# EAGLE design 1 (EAGLE 6.1)
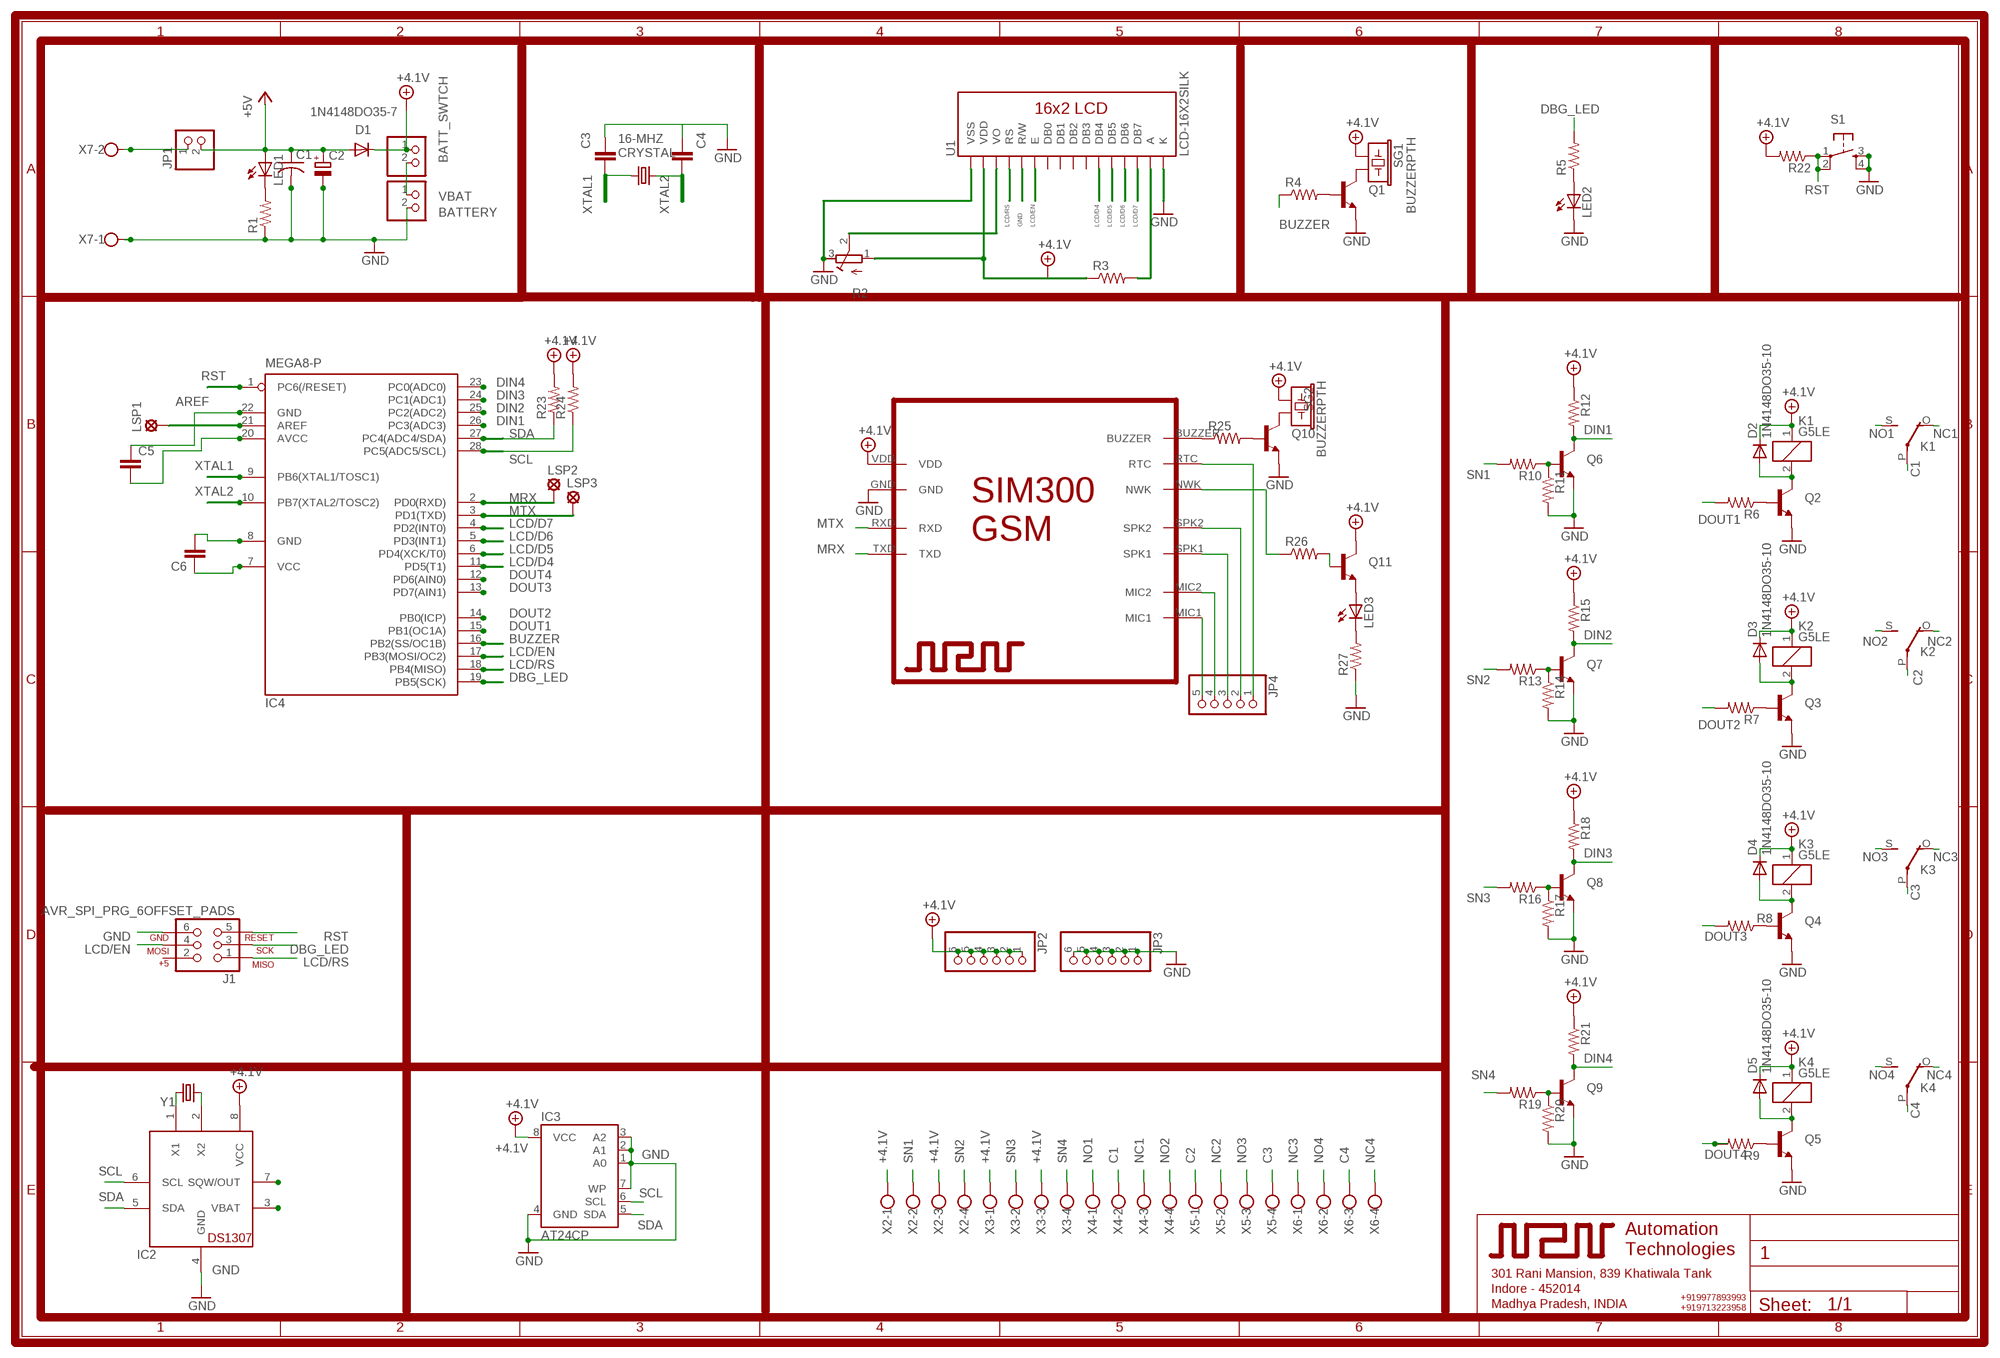
[diagram p0: schematic, sheet 1]

## Parts
BATT_SWTCH  PINHD-1X2  [1X02]
BATTERY  PINHD-1X2  [1X02]
C1  C-US050-035X075  [C050-035X075]
C2  CPOL-EUE3.5-8  [E3,5-8]
C3  CAPPTH1  [CAP-PTH-5MM]
C4  CAPPTH1  [CAP-PTH-5MM]
C5  CAPPTH1  [CAP-PTH-5MM]
C6  CAPPTH1  [CAP-PTH-5MM]
CRYSTAL  16-MHZ  CRYSTALHC49UV  [HC49U-V]
D1  1N4148DO35-7  [DO35-7]
D2  1N4148DO35-10  [DO35-10]
D3  1N4148DO35-10  [DO35-10]
D4  1N4148DO35-10  [DO35-10]
D5  1N4148DO35-10  [DO35-10]
IC2  DS1307  [DIL08]
IC3  AT24CP  [DIL08]
IC4  MEGA8-P  [DIL28-3]
J1  AVR_SPI_PRG_6OFFSET_PADS  [2X3_OFFSET]
JP1  PINHD-1X2  [1X02]
JP2  PINHD-1X6  [1X06]
JP3  PINHD-1X6  [1X06]
JP4  PINHD-1X5  [1X05]
K1  G5LE  [G5LE]
K2  G5LE  [G5LE]
K3  G5LE  [G5LE]
K4  G5LE  [G5LE]
LED1  LED5MM  [LED5MM]
LED2  LED5MM  [LED5MM]
LED3  LED5MM  [LED5MM]
LSP1  LSP11  [LSP11]
LSP2  MCS10B  [MCS10B]
LSP3  MCS10B  [MCS10B]
Q1  TRANSISTOR_NPNTO-92-AMMO  [TO-92-AMMO]
Q2  TRANSISTOR_NPNTO-92-AMMO  [TO-92-AMMO]
Q3  TRANSISTOR_NPNTO-92-AMMO  [TO-92-AMMO]
Q4  TRANSISTOR_NPNTO-92-AMMO  [TO-92-AMMO]
Q5  TRANSISTOR_NPNTO-92-AMMO  [TO-92-AMMO]
Q6  TRANSISTOR_NPNTO-92-AMMO  [TO-92-AMMO]
Q7  TRANSISTOR_NPNTO-92-AMMO  [TO-92-AMMO]
Q8  TRANSISTOR_NPNTO-92-AMMO  [TO-92-AMMO]
Q9  TRANSISTOR_NPNTO-92-AMMO  [TO-92-AMMO]
Q10  TRANSISTOR_NPNTO-92-AMMO  [TO-92-AMMO]
Q11  TRANSISTOR_NPNTO-92-AMMO  [TO-92-AMMO]
R1  RESISTORPTH-1/2W  [AXIAL-0.5]
R2  R-TRIMM3339P  [RTRIM3339P]
R3  RESISTORPTH-1/2W  [AXIAL-0.5]
R4  RESISTORPTH-1/2W  [AXIAL-0.5]
R5  RESISTORPTH-1/2W  [AXIAL-0.5]
R6  RESISTORPTH-1/2W  [AXIAL-0.5]
R7  RESISTORPTH-1/2W  [AXIAL-0.5]
R8  RESISTORPTH-1/2W  [AXIAL-0.5]
R9  RESISTORPTH-1/2W  [AXIAL-0.5]
R10  RESISTORPTH-1/2W  [AXIAL-0.5]
R11  RESISTORPTH-1/2W  [AXIAL-0.5]
R12  RESISTORPTH-1/2W  [AXIAL-0.5]
R13  RESISTORPTH-1/2W  [AXIAL-0.5]
R14  RESISTORPTH-1/2W  [AXIAL-0.5]
R15  RESISTORPTH-1/2W  [AXIAL-0.5]
R16  RESISTORPTH-1/2W  [AXIAL-0.5]
R17  RESISTORPTH-1/2W  [AXIAL-0.5]
R18  RESISTORPTH-1/2W  [AXIAL-0.5]
R19  RESISTORPTH-1/2W  [AXIAL-0.5]
R20  RESISTORPTH-1/2W  [AXIAL-0.5]
R21  RESISTORPTH-1/2W  [AXIAL-0.5]
R22  RESISTORPTH-1/2W  [AXIAL-0.5]
R23  RESISTORPTH-1/2W  [AXIAL-0.5]
R24  RESISTORPTH-1/2W  [AXIAL-0.5]
R25  RESISTORPTH-1/2W  [AXIAL-0.5]
R26  RESISTORPTH-1/2W  [AXIAL-0.5]
R27  RESISTORPTH-1/2W  [AXIAL-0.5]
S1  TAC_SWITCHPTH  [TACTILE-PTH]
SG1  BUZZERPTH  [BUZZER-12MM]
SG2  BUZZERPTH  [BUZZER-12MM]
U1  LCD-16X2SILK  [LCD-16X2]
U$1  SIM300  [1X10]
X2  W237-4  [W237-4]
X3  W237-4  [W237-4]
X4  W237-4  [W237-4]
X5  W237-4  [W237-4]
X6  W237-4  [W237-4]
X7  W237-102  [W237-102]
Y1  CRYSTALTC38H  [TC38H]

## Nets
+4.1V: BATT_SWTCH.1 C5.2 C6.1 D1.C D2.C D3.C D4.C D5.C IC2.8(VCC) IC3.8(VCC) IC4.7(VCC) IC4.20(AVCC) JP2.1 JP2.2 JP2.3 JP2.4 JP2.5 JP2.6 K1.1 K2.1 K3.1 K4.1 Q11.3(C) R2.1(A) R3.P$1 R12.P$1 R15.P$1 R18.P$1 R21.P$1 R22.P$2 R23.P$2 R24.P$2 SG1.+ SG2.+ U1.2(VDD) U$1.VDD X2.1 X2.3 X3.1 X3.3
+5V: C1.1 C2.+ D1.A JP1.2 LED1.A
AREF: IC4.21(AREF) LSP1.MP
BUZZER: IC4.16(PB2(SS/OC1B)) R4.P$1
C1: K1.P(2:P) X4.2
C2: K2.P(2:P) X5.1
C3: K3.P(2:P) X5.4
C4: K4.P(2:P) X6.3
DBG_LED: IC4.19(PB5(SCK)) J1.3 R5.P$2
DIN1: IC4.26(PC3(ADC3)) Q6.3(C) R12.P$2
DIN2: IC4.25(PC2(ADC2)) Q7.3(C) R15.P$2
DIN3: IC4.24(PC1(ADC1)) Q8.3(C) R18.P$2
DIN4: IC4.23(PC0(ADC0)) Q9.3(C) R21.P$2
DOUT1: IC4.15(PB1(OC1A)) R6.P$2
DOUT2: IC4.14(PB0(ICP)) R7.P$2
DOUT3: IC4.13(PD7(AIN1)) R8.P$2
DOUT4: IC4.12(PD6(AIN0)) R9.P$2
GND: BATTERY.2 C1.2 C2.- C3.1 C4.1 C5.1 C6.2 IC2.4(GND) IC3.1(A0) IC3.2(A1) IC3.3(A2) IC3.4(GND) IC3.7(WP) IC4.8(GND) IC4.22(GND) J1.6 JP3.1 JP3.2 JP3.3 JP3.4 JP3.5 JP3.6 LED2.K(C) Q1.1(E) Q2.1(E) Q3.1(E) Q4.1(E) Q5.1(E) Q6.1(E) Q7.1(E) Q8.1(E) Q9.1(E) Q10.1(E) R1.P$1 R2.3(E) R11.P$2 R14.P$2 R17.P$2 R20.P$2 R27.P$1 S1.3 S1.4 U1.1(VSS) U1.5(R/W) U1.16(K) U$1.GND X7.1
LCD/D4: IC4.11(PD5(T1)) U1.11(DB4)
LCD/D5: IC4.6(PD4(XCK/T0)) U1.12(DB5)
LCD/D6: IC4.5(PD3(INT1)) U1.13(DB6)
LCD/D7: IC4.4(PD2(INT0)) U1.14(DB7)
LCD/EN: IC4.17(PB3(MOSI/OC2)) J1.4 U1.6(E)
LCD/RS: IC4.18(PB4(MISO)) J1.1 U1.4(RS)
MRX: IC4.2(PD0(RXD)) LSP2.MP U$1.TXD
MTX: IC4.3(PD1(TXD)) LSP3.MP U$1.RXD
N$1: JP1.1 X7.2
N$2: LED1.K(C) R1.P$2
N$3: LED3.A Q11.1(E)
N$6: R2.2(S) U1.3(VO)
N$7: Q1.3(C) SG1.-
N$8: Q1.2(B) R4.P$2
N$9: LED2.A R5.P$1
N$10: D2.A K1.2 Q2.3(C)
N$11: Q2.2(B) R6.P$1
N$12: D3.A K2.2 Q3.3(C)
N$13: Q3.2(B) R7.P$1
N$14: R3.P$2 U1.15(A)
N$17: D4.A K3.2 Q4.3(C)
N$18: Q4.2(B) R8.P$1
N$19: D5.A K4.2 Q5.3(C)
N$20: Q5.2(B) R9.P$1
N$21: Q6.2(B) R10.P$1 R11.P$1
N$22: JP4.5 U$1.MIC1
N$23: JP4.4 U$1.MIC2
N$24: JP4.3 U$1.SPK1
N$25: Q7.2(B) R13.P$1 R14.P$1
N$26: JP4.2 U$1.SPK2
N$27: JP4.1 U$1.RTC
N$28: Q8.2(B) R16.P$1 R17.P$1
N$29: IC2.1(X1) Y1.2
N$30: R25.P$1 U$1.BUZZER
N$31: Q9.2(B) R19.P$1 R20.P$1
N$32: IC2.2(X2) Y1.1
N$33: Q10.2(B) R25.P$2
N$34: Q10.3(C) SG2.-
N$35: Q11.2(B) R26.P$2
N$36: LED3.K(C) R27.P$2
N$37: R26.P$1 U$1.NWK
N$40: IC2.7(SQW/OUT)
NC1: K1.O(2:O) X4.3
NC2: K2.O(2:O) X5.2
NC3: K3.O(2:O) X6.1
NC4: K4.O(2:O) X6.4
NO1: K1.S(2:S) X4.1
NO2: K2.S(2:S) X4.4
NO3: K3.S(2:S) X5.3
NO4: K4.S(2:S) X6.2
RST: IC4.1(PC6(/RESET)) J1.5 R22.P$1 S1.1 S1.2
SCL: IC2.6(SCL) IC3.6(SCL) IC4.28(PC5(ADC5/SCL)) R24.P$1
SDA: IC2.5(SDA) IC3.5(SDA) IC4.27(PC4(ADC4/SDA)) R23.P$1
SN1: R10.P$2 X2.2
SN2: R13.P$2 X2.4
SN3: R16.P$2 X3.2
SN4: R19.P$2 X3.4
VBAT: BATT_SWTCH.2 BATTERY.1 IC2.3(VBAT)
XTAL1: C3.2 CRYSTAL.1 IC4.9(PB6(XTAL1/TOSC1))
XTAL2: C4.2 CRYSTAL.2 IC4.10(PB7(XTAL2/TOSC2))
Unconnected: J1.2 U1.7(DB0) U1.8(DB1) U1.9(DB2) U1.10(DB3)

## Library data of the parts
BATT_SWTCH BATTERY JP1 = pinhead:PINHD-1X2: PIN HEADER
C1 = rcl:C-US: CAPACITOR, American symbol
C2 = rcl:CPOL-EU: POLARIZED CAPACITOR, European symbol
C3-C6 = SparkFun_NPN:CAP: Capacitor Standard 0603 ceramic capacitor, and 0.1" leaded capacitor.
CRYSTAL Y1 = SparkFun_NPN:CRYSTAL: Crystals Various standard crystals. Proven footprints. Spark Fun Electronics SKU : COM-00534
D1-D5 = diode:1N4148: DIODE high speed (Philips)
IC2 = adafruit:DS1307: DS1307 Real time clock (RTC) with battery backup ability. Talk to it via i2c
IC3 = atmel:AT24C*: 2-wire serial EEPROM; MPN: AT24C1024BW-SH-B; OC_FARNELL: 1362646; OC_NEWARK: 03P2044
IC4 = atmel:MEGA8-P: MICROCONTROLLER 8 Kbytes FLASH, 1 kbytes SRAM, 512 bytes EEPROM, USART, 4-channel 10 bit ADC, 2-channel 8 bit ADC Pin compatible with Atmega48, ATMega88, ATMega168 Source: avr.lbr; OC_FARNELL: unknown; OC_NEWARK: unknown
J1 = SparkFun:AVR_SPI_PRG_6: AVR ISP 6 Pin This is the reduced ISP connector for AVR programming. Common on Arduino. This footprint will take up less PCB space and can be used with a 10-pin to 6-pin adapter such as SKU: BOB-08508
JP2 JP3 = pinhead:PINHD-1X6: PIN HEADER
JP4 = pinhead:PINHD-1X5: PIN HEADER
K1-K4 = relay:G5LE: RELAY 1 x switch, 10 A/120 V AC, 8 A/30 V DC, Omron; OC_FARNELL: unknown; OC_NEWARK: unknown
LED1-LED3 = led:LED: LED OSRAM: - CHIPLED LG R971, LG N971, LY N971, LG Q971, LY Q971, LO R971, LY R971 LH N974, LH R974 LS Q976, LO Q976, LY Q976 LO Q996 - Hyper CHIPLED LW Q18S LB Q993, LB Q99A, LB R99A - SideLED LS A670, LO A670, LY A670, LG A670, LP A670 LB A673, LV A673, LT A673, LW A673 LH A674 LY A675 LS A676, LA A676, LO A676, LY A676, LW A676 LS A679, LY A679, LG A679 - Hyper Micro SIDELED® LS Y876, LA Y876, LO Y876, LY Y876 LT Y87S - SmartLED LW L88C, LW L88S LB L89C, LB L89S, LG L890 LS L89K, LO L89K, LY L89K LS L896, LA L896, LO L896, LY L896 - TOPLED LS T670, LO T670, LY T670, LG T670, LP T670 LSG T670, LSP T670, LSY T670, LOP T670, LYG T670 LG T671, LOG T671, LSG T671 LB T673, LV T673, LT T673, LW T673 LH T674 LS T676, LA T676, LO T676, LY T676, LB T676, LH T676, LSB T676, LW T676 LB T67C, LV T67C, LT T67C, LS T67K, LO T67K, LY T67K, LW E67C LS E67B, LA E67B, LO E67B, LY E67B, LB E67C, LV E67C, LT E67C LW T67C LS T679, LY T679, LG T679 LS T770, LO T770, LY T770, LG T770, LP T770 LB T773, LV T773, LT T773, LW T773 LH T774 LS E675, LA E675, LY E675, LS T675 LS T776, LA T776, LO T776, LY T776, LB T776 LHGB T686 LT T68C, LB T68C - Hyper Mini TOPLED® LB M676 - Mini TOPLED Santana® LG M470 LS M47K, LO M47K, LY M47K Source: http://www.osram.convergy.de LUXEON: - LUMILED® LXK2-PW12-R00, LXK2-PW12-S00, LXK2-PW14-U00, LXK2-PW14-V00 LXK2-PM12-R00, LXK2-PM12-S00, LXK2-PM14-U00 LXK2-PE12-Q00, LXK2-PE12-R00, LXK2-PE12-S00, LXK2-PE14-T00, LXK2-PE14-U00 LXK2-PB12-K00, LXK2-PB12-L00, LXK2-PB12-M00, LXK2-PB14-N00, LXK2-PB14-P00, LXK2-PB14-Q00 LXK2-PR12-L00, LXK2-PR12-M00, LXK2-PR14-Q00, LXK2-PR14-R00 LXK2-PD12-Q00, LXK2-PD12-R00, LXK2-PD12-S00 LXK2-PH12-R00, LXK2-PH12-S00 LXK2-PL12-P00, LXK2-PL12-Q00, LXK2-PL12-R00 Source: www.luxeon.com KINGBRIGHT: KA-3528ASYC Source: www.kingbright.com
LSP1 = solpad:LSP11: SOLDER PAD drill 1.1 mm
LSP2 LSP3 = solpad:MCS10B: SOLDER PAD MC S1, distributor Buerklin, 15F505
Q1-Q11 = SparkFun_NPN:TRANSISTOR_NPN: Transistor NPN BJT configuration in SOT23 package. MMBT2222 is the common NPN we use. Double check BCE configuration again layout.
R1 R3-R27 = SparkFun_NPN:RESISTOR: Resistor Basic schematic elements and footprints for 0603, 1206, and PTH resistors.
R2 = rcl:R-TRIMM: Trimm resistor
S1 = SparkFun_NPN:TAC_SWITCH: Momentary Switch Button commonly used for reset or general input. Spark Fun Electronics SKU : COM-00097
SG1 SG2 = SparkFun_NPN:BUZZER: Buzzer 12mm Spark Fun Electronics SKU : Comp-Buzzer
U1 = SparkFun_NPN:LCD-16X2
U$1 = NPN:SIM300
X2-X6 = con-wago-500:W237-4: WAGO SCREW CLAMP; OC_FARNELL: unknown; OC_NEWARK: unknown
X7 = con-wago-500:W237-102: WAGO SCREW CLAMP; MPN: 237-102; OC_FARNELL: unknown; OC_NEWARK: 70K9898

## Board
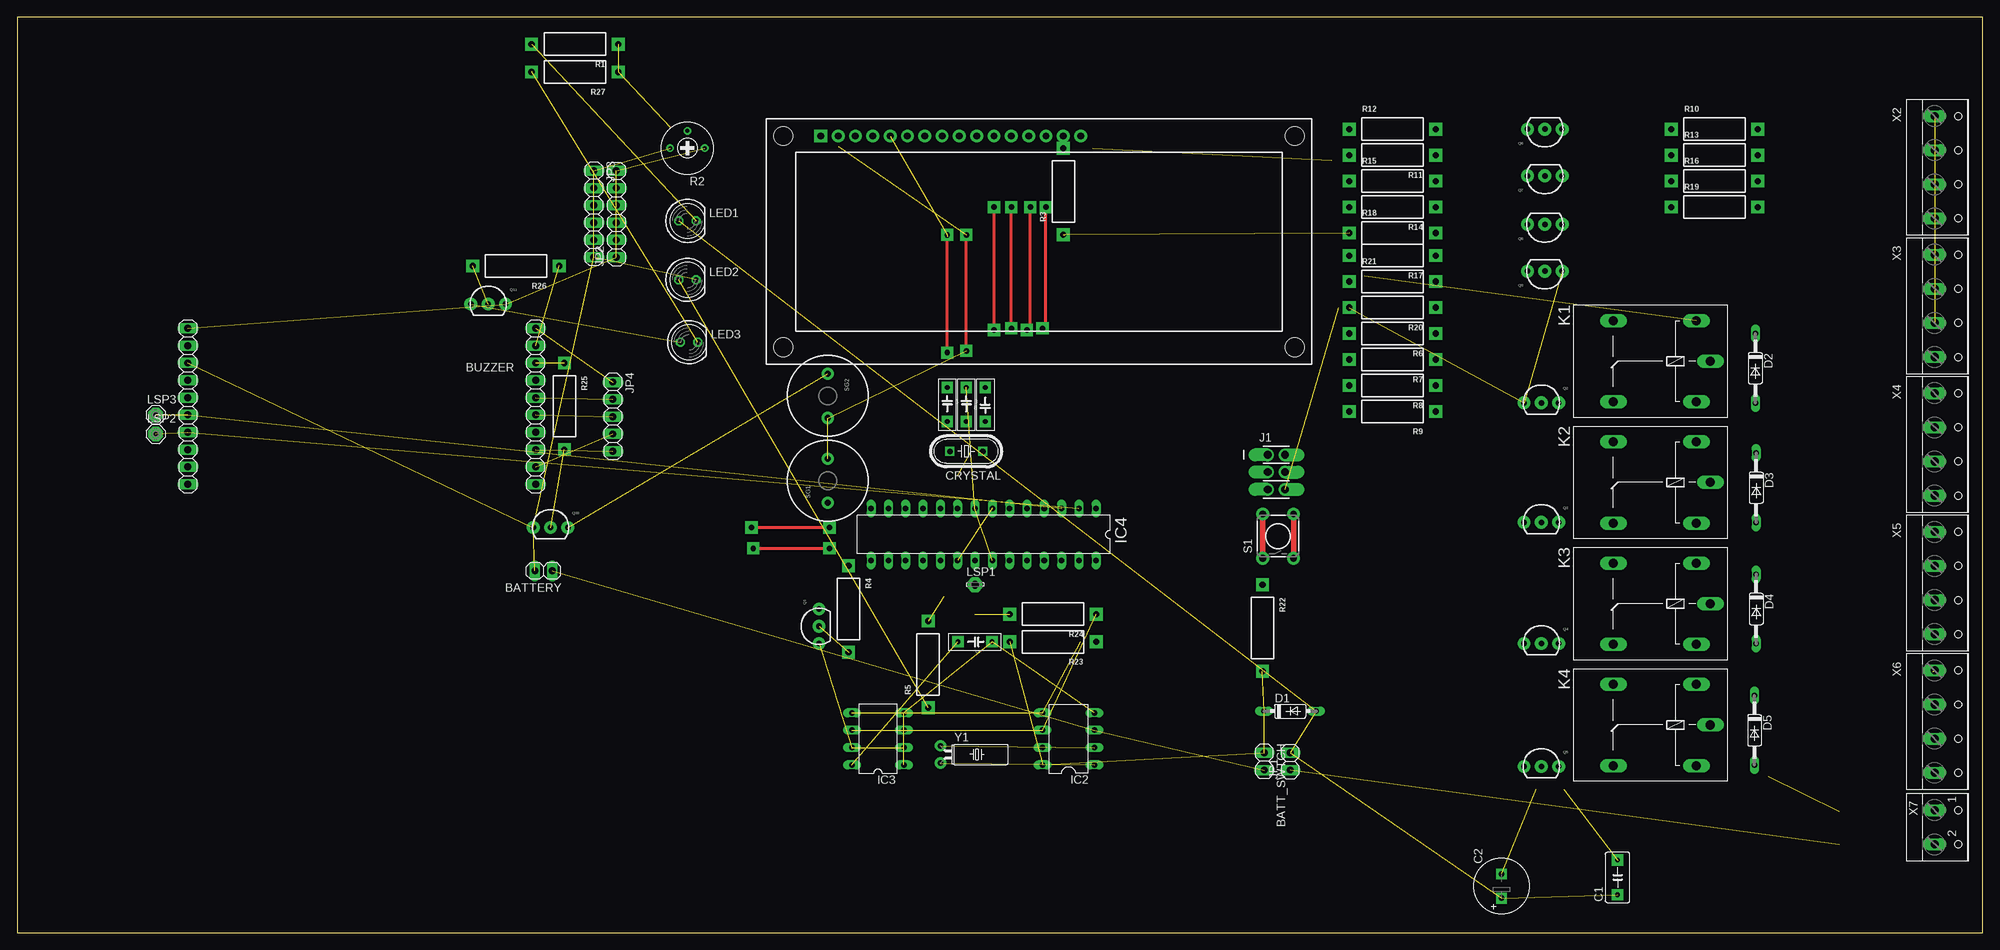
[diagram p1: board, top side]
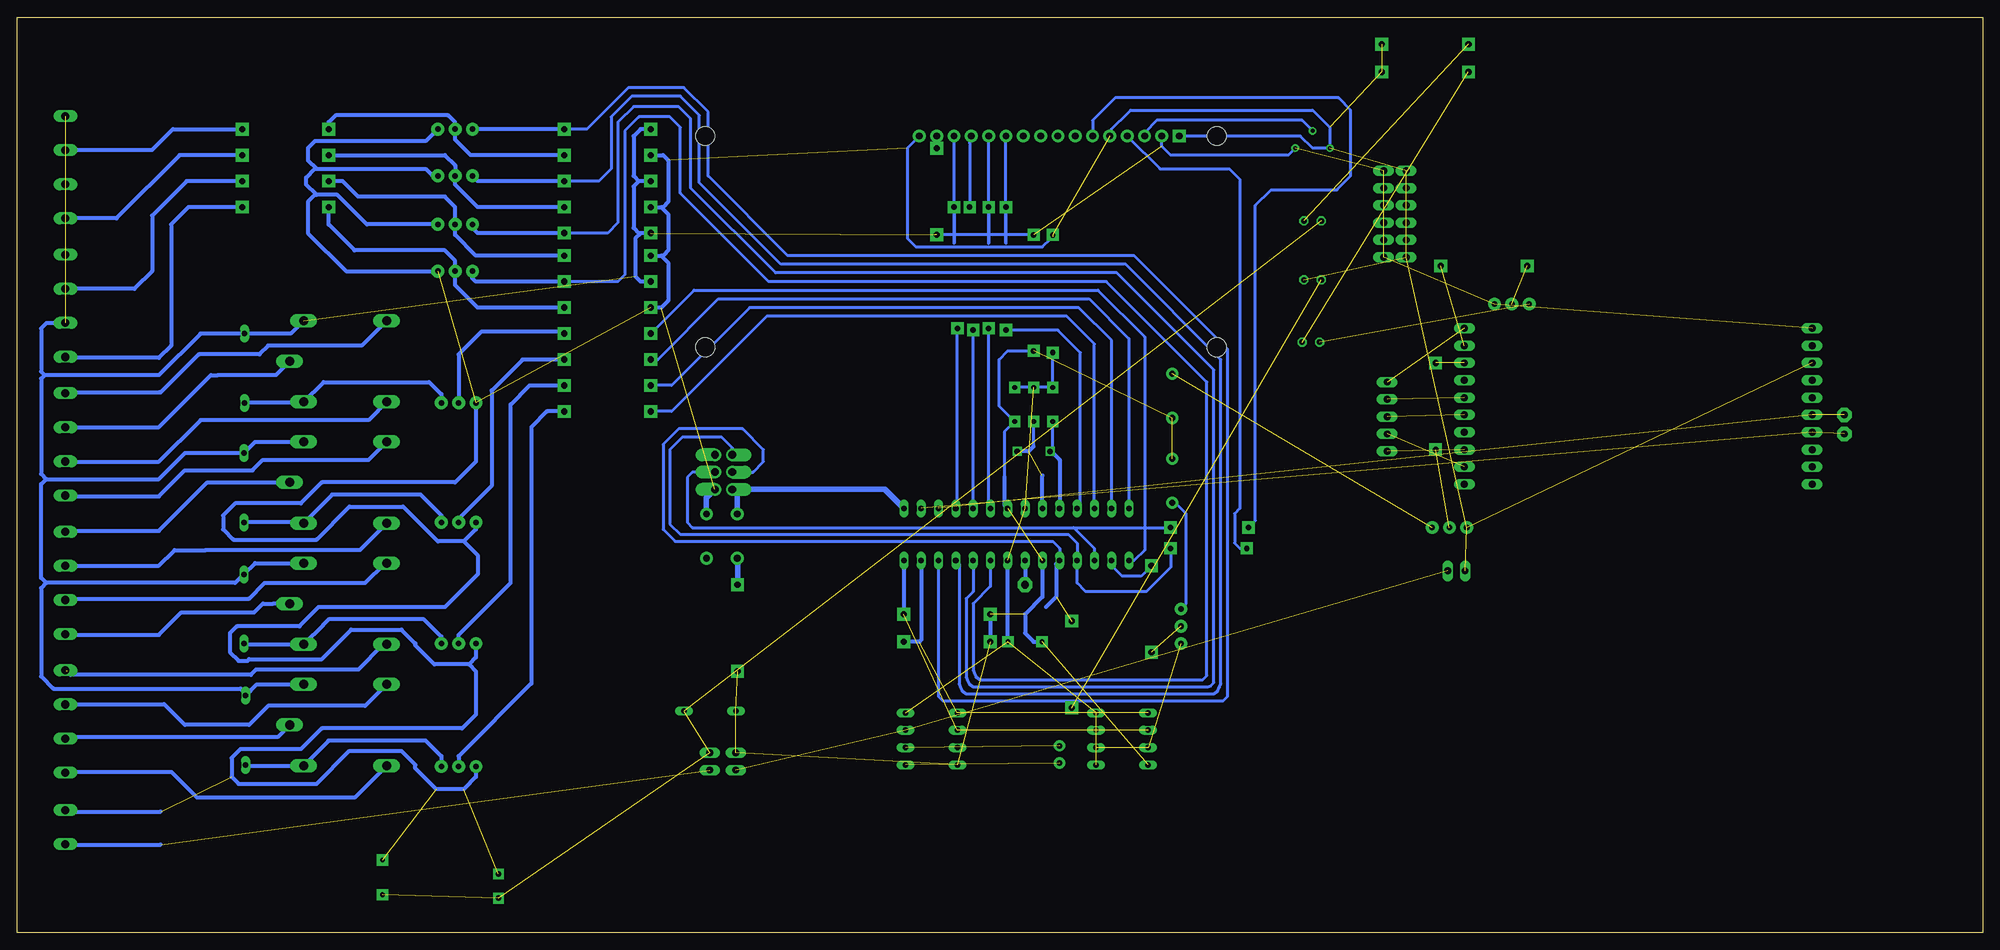
[diagram p2: board, bottom side, seen from below]

Size 288.27 x 134.29 mm. Coordinates in mm from the lower left corner, seen from the top.
Outline: 0,0 288.27,0 288.27,134.29 0,134.29 0,0
Copper layers (1*16): Top 0.035mm / dielectric 1.5mm / Bottom 0.035mm
Design rules: minimum track width 10mil, minimum drill 24mil, track to track 8mil, track to pad 8mil, pad to pad 8mil, via to via 8mil, smd to smd 8mil, copper to edge 40mil, drill to drill 8mil, minimum pad ring 10mil, minimum via ring 8mil, stop-mask expansion 4mil, vias tented up to drill 0mil, thermal gap 10mil

### Footprints (pad centres in the part's own frame; a part is rotated, then mirrored left to right if it is on the bottom)
1X02 = drill 1.016 long: 1 -1.27,0; 2 1.27,0
C050-035X075 = drill 0.7 pad 1.676 square: 1 -2.54,0; 2 2.54,0
E3,5-8 = drill 0.813 pad 1.6 square: + -1.778,0; - 1.778,0
CAP-PTH-5MM = drill 0.7 pad 1.651 square: 1 -2.5,0; 2 2.5,0
HC49U-V = drill 0.813 square: 1 -2.413,0; 2 2.413,0
DO35-7 = drill 0.813 long: A 3.81,0; C -3.81,0
DO35-10 = drill 0.813 long: A 5.08,0; C -5.08,0
DIL08 = drill 0.813 long: 1 -3.81,-3.81; 2 -1.27,-3.81; 3 1.27,-3.81; 4 3.81,-3.81; 5 3.81,3.81; 6 1.27,3.81; 7 -1.27,3.81; 8 -3.81,3.81
DIL28-3 = drill 0.813 long: 1 -16.51,-3.81; 2 -13.97,-3.81; 3 -11.43,-3.81; 4 -8.89,-3.81; 5 -6.35,-3.81; 6 -3.81,-3.81; 7 -1.27,-3.81; 8 1.27,-3.81; 9 3.81,-3.81; 10 6.35,-3.81; 11 8.89,-3.81; 12 11.43,-3.81; 13 13.97,-3.81; 14 16.51,-3.81; 15 16.51,3.81; 16 13.97,3.81; 17 11.43,3.81; 18 8.89,3.81; 19 6.35,3.81; 20 3.81,3.81; 21 1.27,3.81; 22 -1.27,3.81; 23 -3.81,3.81; 24 -6.35,3.81; 25 -8.89,3.81; 26 -11.43,3.81; 27 -13.97,3.81; 28 -16.51,3.81
2X3_OFFSET = drill 1.118 pad 1.88 offset: 1 -2.54,-1.27; 2 -2.54,1.27; 3 0,-1.27; 4 0,1.27; 5 2.54,-1.27; 6 2.54,1.27
1X06 = drill 1.016 long: 1 -6.35,0; 2 -3.81,0; 3 -1.27,0; 4 1.27,0; 5 3.81,0; 6 6.35,0
1X05 = drill 1.016 long: 1 -5.08,0; 2 -2.54,0; 3 0,0; 4 2.54,0; 5 5.08,0
G5LE = drill 1.321 long: 1 -7.493,-5.969; 2 -7.493,5.969; O 4.699,5.969; P -9.525,0; S 4.699,-5.969
LED5MM = drill 0.813 octagon: A -1.27,0; K 1.27,0
LSP11 = drill 1.118 pad 2.159 octagon: MP 0,0
MCS10B = drill 1.016 pad 2.159 octagon: MP 0,0
TO-92-AMMO = drill 0.813 pad 1.88: 1 -2.54,0; 2 0,0; 3 2.54,0
AXIAL-0.5 = drill 0.9 pad 1.88 square: P$1 -6.35,0; P$2 6.35,0
RTRIM3339P = drill 0.61: 1 -2.54,0; 2 0,-2.54; 3 2.54,0
TACTILE-PTH = drill 1.016 pad 1.88: 1 -3.251,2.261; 2 3.251,2.261; 3 -3.251,-2.261; 4 3.251,-2.261
BUZZER-12MM = drill 0.9 pad 1.778: + 3.25,0; - -3.25,0
LCD-16X2 = drill 1.016 pad 1.88 square: 1 -32,15.5 | drill 1.016 pad 1.88: 2 -29.46,15.5; 3 -26.92,15.5; 4 -24.38,15.5; 5 -21.84,15.5; 6 -19.3,15.5; 7 -16.76,15.5; 8 -14.22,15.5; 9 -11.68,15.5; 10 -9.14,15.5; 11 -6.6,15.5; 12 -4.06,15.5; 13 -1.52,15.5; 14 1.02,15.5; 15 3.56,15.5; 16 6.1,15.5 | hole 2.8: -37.5,15.5; -37.5,-15.5; 37.5,15.5; 37.5,-15.5
1X10 = drill 1.016 long: 17 25.5,3.81; ADC0 -25.5,-11.43; AGND 25.5,-3.81; BUZZER 25.5,6.35; CTS -25.5,-8.89; GND -25.5,6.35; GND1 -25.5,3.81; GND2 25.5,-11.43; MIC1 25.5,-6.35; MIC2 25.5,-8.89; NWK 25.5,8.89; PS-ON -25.5,1.27; RTC 25.5,11.43; RTS -25.5,-6.35; RXD -25.5,-1.27; SPK1 25.5,-1.27; SPK2 25.5,1.27; TXD -25.5,-3.81; VDD -25.5,11.43; VDD1 -25.5,8.89
W237-4 = drill 1.194 long: 1 -7.5,-1.27; 2 -2.5,-1.27; 3 2.5,-1.27; 4 7.5,-1.27
W237-102 = drill 1.194 long: 1 -2.5,-1.27; 2 2.5,-1.27
TC38H = drill 0.813 pad 1.676: 1 -1.27,0; 2 1.27,0

### Placement (x,y rotation side)
BATT_SWTCH  182.88,25.15 270 top
BATTERY  77.22,53.09 180 top
C1  234.7,8.13 90 top
C2  217.68,6.86 90 top
C3  139.19,77.47 270 top
C4  136.4,77.47 270 top
C5  140.46,42.67 180 top
C6  141.99,77.47 90 top
CRYSTAL  139.19,70.61 180 top
D1  186.69,32.51 0 top
D2  254.89,82.8 270 top
D3  255.02,65.28 270 top
D4  255.02,47.5 270 top
D5  254.76,29.72 270 top
IC2  154.18,28.45 90 top
IC3  126.24,28.45 90 top
IC4  141.73,58.42 180 top
J1  184.66,67.56 270 top
JP1  186.69,25.15 90 top
JP2  87.88,105.41 90 top
JP3  84.58,105.41 270 top
JP4  87.38,75.69 270 top
K1  238.76,83.82 180 top
K2  238.76,66.04 180 top
K3  238.76,48.26 180 top
K4  238.76,30.48 180 top
LED1  98.3,104.39 0 top
LED2  98.3,95.76 0 top
LED3  98.55,86.61 0 top
LSP1  140.46,51.05 0 top
LSP2  20.32,73.15 0 top
LSP3  20.32,75.95 0 top
Q1  117.6,44.96 90 top
Q2  223.52,77.72 0 top
Q3  223.52,60.2 0 top
Q4  223.52,42.42 0 top
Q5  223.52,24.38 0 top
Q6  224.03,117.86 180 top
Q7  224.03,111 180 top
Q8  224.03,103.89 180 top
Q9  224.03,97.03 180 top
Q10  78.23,59.44 0 top
Q11  69.09,92.2 0 top
R1  81.79,130.3 180 top
R2  98.3,115.06 180 top
R3  153.42,108.71 90 top
R4  121.92,47.5 270 top
R5  133.6,39.37 90 top
R6  201.68,87.88 180 top
R7  201.68,84.07 180 top
R8  201.68,80.26 180 top
R9  201.68,76.45 180 top
R10  248.92,117.86 0 top
R11  201.68,114.05 180 top
R12  201.68,117.86 0 top
R13  248.92,114.05 0 top
R14  201.68,106.43 180 top
R15  201.68,110.24 0 top
R16  248.92,110.24 0 top
R17  201.68,99.31 180 top
R18  201.68,102.62 0 top
R19  248.92,106.43 0 top
R20  201.68,91.69 180 top
R21  201.68,95.5 0 top
R22  182.63,44.7 270 top
R23  151.89,42.67 180 top
R24  151.89,46.74 180 top
R25  80.26,77.22 270 top
R26  73.15,97.79 180 top
R27  81.79,126.24 180 top
S1  184.91,58.17 90 top
SG1  118.87,66.29 90 top
SG2  118.87,78.74 270 top
U1  149.86,101.35 0 top
U$1  50.55,77.22 0 top
X2  282.45,112.27 270 top
X3  282.45,91.95 270 top
X4  282.45,71.63 270 top
X5  282.45,51.31 270 top
X6  282.45,30.99 270 top
X7  282.45,15.49 270 top
Y1  135.38,26.16 270 top

### Tracks (layer width: path | path; a pad name or v marks a point on that pad's centre or on a via)
+4.1V  (via drill 0.8 pad 1.78)  (24 unrouted)
  Top 0.406: v139.19,85.34 v139.19,102.36
  Bottom 0.406: 143.51,66.55 143.51,73.45 C6.1 144.27,77.26 144.27,84.07 143,85.34 v139.19,85.34 | v139.19,102.36 153.67,102.36 | R2.1 101.85,114.05 119.13,114.05 120.4,115.32 U1.2
  Bottom 0.61: K1.1 248.16,87.88 D2.C 261.37,87.88 267.46,81.79 284.23,81.79 | X3.3 281.22,89.41 283.97,89.41 284.73,88.65 284.73,82.3 284.23,81.79 | K2.1 253.37,72.01 D3.C 263.65,70.36 267.46,66.55 283.97,66.55 | 284.23,81.79 284.73,81.28 284.73,67.31 283.97,66.55 | 283.97,51.31 284.73,52.07 284.73,65.79 283.97,66.55 | K3.1 253.37,54.23 D4.C 256.29,51.31 283.97,51.31 | 283.97,51.31 284.73,50.55 284.73,37.59 282.96,35.81 255.52,35.81 254.76,35.05 D5.C 253.11,36.45 K4.1 | R12.P$1 196.85,117.86 197.87,116.84 197.87,111 197.1,110.24 | R15.P$1 197.1,110.24 | 197.1,110.24 197.87,109.47 197.87,103.38 197.1,102.62 196.85,102.62 | R18.P$1 196.85,102.62 | 196.85,102.62 197.61,101.85 197.61,96.27 196.85,95.5 R21.P$1 | 143.51,66.84 143.51,66.55 143.51,62.74 IC4.7 | 137.92,42.71 C5.2 139.19,42.67 140.46,43.94 140.46,46.74 137.92,49.28 IC4.20 | R24.P$2 R23.P$2
+5V  (4 unrouted)
AREF
  Bottom 0.61: IC4.21 LSP1.MP
BUZZER
  Bottom 0.406: R4.P$1 123.44,52.32 126.24,52.32 127.76,53.85 IC4.16
C1
  Bottom 0.61: K1.P 250.32,81.79 258.57,81.79 258.83,81.79 259.84,81.79 267.46,74.17 281.14,74.17 X4.2
C2
  Bottom 0.61: X5.1 281.06,58.93 267.46,58.93 260.35,66.04 K2.P
C3
  Bottom 0.61: X5.4 281.06,43.69 267.46,43.69 264.16,46.99 253.49,46.99 252.22,48.26 250.7,48.26 250.19,48.26 K3.P
C4
  Bottom 0.61: X6.3 280.96,28.7 250.06,28.7 K4.P
DBG_LED  (1 unrouted)
  Bottom 0.406: J1.3 180.34,67.56 178.82,69.09 178.82,70.87 181.86,73.91 191.26,73.91 193.55,71.63 193.55,59.18 191.77,57.4 136.4,57.4 135.38,56.39 IC4.19
  Bottom 0.61: IC4.19 135.89,54.1 135.89,49.28 137.41,47.75
DIN1
  Bottom 0.406: IC4.26 153.16,34.67 152.53,34.04 111.38,34.04 110.74,34.67 110.74,85.6 124.46,99.31 175.26,99.31 186.94,111 186.94,120.4 190.5,123.95 198.63,123.95 204.72,117.86 R12.P$2
  Bottom 0.61: R12.P$2 Q6.3
DIN2
  Bottom 0.406: IC4.25 150.11,54.1 150.11,36.46 149.93,36.02 149.67,35.43 149.09,35.05 112.8,35.05 112.22,35.42 111.96,35.98 111.96,35.99 111.95,35.99 111.95,36 111.81,36.31 111.76,36.56 111.76,84.07 125.73,98.04 176.28,98.04 188.21,109.98 188.21,119.89 191.01,122.68 198.12,122.68 201.17,119.63 201.17,112.01 202.95,110.24 R15.P$2
  Bottom 0.61: R15.P$2 220.73,110.24 Q7.3
DIN3
  Bottom 0.406: IC4.24 148.08,50.04 149.1,49.02 149.1,37.47 148.91,37.02 148.63,36.43 148.06,36.07 113.67,36.07 113.22,36.25 112.78,36.7 112.78,82.55 127,96.77 177.04,96.77 189.48,109.22 189.48,119.38 191.26,121.16 197.87,121.16 200.15,118.87 200.15,104.14 201.68,102.62 R18.P$2
  Bottom 0.61: R18.P$2 220.73,102.62 221.49,103.38 Q8.3
DIN4
  Bottom 0.406: IC4.23 145.54,50.8 148.08,48.26 148.08,38.49 147.9,38.04 147.62,37.45 147.04,37.08 114.43,37.08 113.79,37.72 113.79,80.77 128.52,95.5 178.05,95.5 191.01,108.46 191.01,118.11 192.53,119.63 197.1,119.63 199.14,117.6 199.14,96.52 200.15,95.5 R21.P$2
  Bottom 0.61: R21.P$2 220.98,95.5 221.49,96.01 Q9.3
DOUT1
  Bottom 0.406: R6.P$2 188.98,94.23 129.79,94.23 122.94,87.38 122.94,56.13 124.46,54.61 IC4.15
DOUT2
  Bottom 0.406: R7.P$2 194.31,84.07 185.42,92.96 131.06,92.96 125.22,87.12 IC4.14
DOUT3
  Bottom 0.406: IC4.13 127.76,86.87 132.59,91.69 180.85,91.69 192.28,80.26 R8.P$2 195.83,80.26
DOUT4
  Bottom 0.406: IC4.12 130.3,86.36 134.37,90.42 178.31,90.42 192.28,76.45 R9.P$2
GND  (via drill 0.8 pad 1.78)  (30 unrouted)
  Top 0.406: v136.4,85.09 v136.4,102.36
  Top 0.813: S1.4 S1.3
  Bottom 0.406: C6.2 C3.1 C4.1 v136.4,85.09 | v136.4,102.36 136.14,101.85 | U1.16 157.73,115.07 157.73,101.85 156.46,100.58 137.92,100.58 136.65,101.85 136.4,101.85 136.4,102.11 | U1.1 100.08,116.85 98.3,115.06 R2.3 95.76,118.11 98.3,120.65 124.97,120.65 128.02,117.6 U1.5
  Bottom 0.61: X7.1 280.96,17.78 267.21,17.78 | Q6.1 228.35,116.08 244.6,116.08 245.62,115.06 245.62,113.28 244.35,112.01 | 244.35,112.01 228.35,112.01 227.33,111 Q7.1 | 244.35,108.2 245.87,109.73 245.87,110.74 244.6,112.01 244.35,112.01 | Q8.1 236.98,103.89 241.3,108.2 244.35,108.2 | 244.35,108.2 244.6,108.2 245.62,107.19 245.62,102.62 240.03,97.03 Q9.1 | R11.P$2 193.55,114.05 192.79,113.28 192.79,107.19 193.55,106.43 193.8,106.43 | R14.P$2 193.8,106.43 | 193.8,106.43 192.79,105.41 192.79,100.08 193.55,99.31 193.8,99.31 | R17.P$2 193.8,99.31 | 193.8,99.31 192.79,98.3 192.79,92.71 193.8,91.69 R20.P$2 | Q2.1 220.98,69.09 224.03,66.04 243.59,66.04 246.63,62.99 256.29,62.99 258.06,61.21 258.06,59.18 256.54,57.66 244.35,57.66 239.52,62.48 231.65,62.48 226.57,57.4 222.76,57.4 | Q3.1 220.98,59.18 222.76,57.4 | 222.76,57.4 220.73,55.37 220.73,52.58 225.55,47.75 244.09,47.75 246.89,44.96 256.03,44.96 257.05,43.94 257.05,41.15 255.78,39.88 254.51,39.88 254.25,40.13 243.59,40.13 239.27,44.45 231.9,44.45 229.87,42.42 229.87,42.16 227.08,39.37 222,39.37 | Q4.1 220.98,40.39 222,39.37 | 222,39.37 220.98,38.35 220.98,32 223.01,29.97 243.59,29.97 246.63,26.92 255.52,26.92 256.79,25.65 256.79,22.86 255.78,21.84 244.35,21.84 239.52,26.67 231.9,26.67 229.87,24.64 229.87,24.13 226.82,21.08 222.76,21.08 220.98,22.86 Q5.1 | C5.1 143,42.71 IC4.22
  Bottom 0.813: J1.6 187.17,63.78 S1.4
LCD/D4  (via drill 0.8 pad 1.78)
  Top 0.406: v143.26,88.39 v143.26,106.43
  Bottom 0.406: IC4.11 132.33,62.74 132.33,85.09 135.64,88.39 v143.26,88.39 | v143.26,106.43 143.26,101.1 U1.11
LCD/D5  (via drill 0.8 pad 1.78)
  Top 0.406: v145.8,88.65 v145.8,106.43
  Bottom 0.406: IC4.6 145.8,62.48 v145.8,88.65 | v145.8,106.43 145.8,101.1 U1.12
LCD/D6  (via drill 0.8 pad 1.78)
  Top 0.406: v148.08,88.39 148.59,88.9 v148.59,106.43
  Bottom 0.406: IC4.5 v148.08,88.39 | U1.13 148.34,116.08 148.59,115.82 v148.59,106.43
LCD/D7  (via drill 0.8 pad 1.78)
  Top 0.406: v150.37,88.65 150.88,89.15 v150.88,106.43
  Bottom 0.406: IC4.4 150.37,62.48 v150.37,88.65 | v150.88,106.43 150.88,101.1 U1.14
LCD/EN  (via drill 0.8 pad 1.78)
  Top 0.406: v119.13,59.44 v107.7,59.44
  Bottom 0.406: 133.35,59.44 189.23,59.44 189.99,60.2 189.99,66.8 189.23,67.56 J1.4 | 133.35,59.44 130.3,56.39 IC4.17 | 133.35,59.44 v119.13,59.44 | v107.7,59.44 106.68,60.45 106.68,106.68 104.39,108.97 94.74,108.97 92.71,111 92.71,120.65 94.49,122.43 127.25,122.43 130.56,119.12 U1.6
LCD/RS  (via drill 0.8 pad 1.78)
  Top 0.406: v107.95,56.39 v119.13,56.39 119.38,56.39
  Bottom 0.406: J1.1 183.39,71.12 184.91,72.64 190.75,72.64 192.53,70.87 192.53,59.94 191.01,58.42 134.11,58.42 132.84,57.15 IC4.18 132.84,51.31 131.57,50.04 122.68,50.04 119.13,53.59 v119.13,56.39 | U1.4 120.65,112.01 110.49,112.01 108.97,110.49 108.97,62.23 109.73,61.47 109.73,57.15 108.97,56.39 v107.95,56.39
MRX  (2 unrouted)
MTX  (2 unrouted)
N$1  (1 unrouted)
  Bottom 0.61: X7.2 281.14,12.95 267.21,12.95
N$2  (1 unrouted)
N$3  (1 unrouted)
N$6
  Bottom 0.406: R2.2 99.82,119.13 121.16,119.13 122.94,117.34 U1.3
N$7
  Bottom 0.406: Q1.3 116.84,48.26 116.84,61.47 118.42,63.04 SG1.-
N$8  (1 unrouted)
N$9  (1 unrouted)
N$10
  Bottom 0.61: D2.A 246.38,77.72 K1.2 243.33,80.77 227.84,80.77 226.06,78.99 Q2.3
N$11
  Bottom 0.61: R6.P$1 208.28,88.14 220.22,88.14 223.52,84.84 Q2.2
N$12
  Bottom 0.61: D3.A 246.38,60.2 K2.2 242.06,64.26 229.11,64.26 226.06,61.21 Q3.3
N$13
  Bottom 0.61: R7.P$1 214.12,84.07 218.69,79.5 218.69,65.53 223.52,60.71 Q3.2
N$14
  Bottom 0.406: R3.P$2 153.42,115.31 U1.15
N$17
  Bottom 0.61: D4.A 254.89,42.29 K3.2 243.33,45.21 243.08,45.47 242.57,45.97 228.6,45.97 226.06,43.43 Q4.3
N$18
  Bottom 0.61: Q4.2 223.52,43.69 215.9,51.31 215.9,77.47 213.11,80.26 R8.P$1
N$19
  Bottom 0.61: D5.A 254.63,24.51 K4.2 242.57,28.19 228.35,28.19 226.06,25.91 Q5.3
N$20
  Bottom 0.61: R9.P$1 210.57,76.45 212.85,74.17 212.85,36.58 223.52,25.91 Q5.2
N$21
  Bottom 0.61: R10.P$1 242.57,118.87 241.55,119.89 225.04,119.89 224.03,118.87 Q6.2 224.03,116.33 221.74,114.05 R11.P$1
N$22  (1 unrouted)
N$23  (1 unrouted)
N$24  (1 unrouted)
N$25
  Bottom 0.61: R13.P$1 225.55,114.05 224.03,112.52 Q7.2 224.03,109.73 220.73,106.43 R14.P$1
N$26  (1 unrouted)
N$27  (1 unrouted)
N$28
  Bottom 0.61: R16.P$1 240.54,110.24 238.25,107.95 225.55,107.95 224.03,106.43 Q8.2 224.03,102.36 220.98,99.31 R17.P$1
N$29  (1 unrouted)
N$30  (1 unrouted)
N$31
  Bottom 0.61: R19.P$1 242.57,103.89 238.76,100.08 225.55,100.08 224.03,98.55 Q9.2 224.03,95 220.73,91.69 R20.P$1
N$32  (1 unrouted)
N$33  (1 unrouted)
N$34  (1 unrouted)
N$35  (1 unrouted)
N$36  (1 unrouted)
N$37  (1 unrouted)
NC1
  Bottom 0.61: K1.O 236.73,75.18 261.37,75.18 267.46,69.09 281.14,69.09 X4.3
NC2
  Bottom 0.61: X5.2 281.14,53.85 267.46,53.85 265.18,56.13 260.6,56.13 260.35,56.13 238,56.13 K2.O
NC3  (1 unrouted)
  Bottom 0.61: X6.1 281.04,38.35 | K3.O 234.57,42.29 238.25,38.61 253.24,38.61 254,37.85 280.42,37.85 280.92,38.35 281.18,38.35
NC4
  Bottom 0.61: X6.4 281.04,23.62 265.68,23.62 261.87,19.81 238.76,19.81 K4.O
NO1
  Bottom 0.61: K1.S 237.74,86.11 251.46,86.11 252.73,84.84 261.62,84.84 267.21,79.25 267.46,79.25 268.73,79.25 281.06,79.25 X4.1
NO2
  Bottom 0.61: X4.4 281.06,64.01 267.46,64.01 263.65,67.82 253.75,67.82 252.22,69.34 236.73,69.34 K2.S
NO3
  Bottom 0.61: X5.3 280.96,49.02 254.25,49.02 251.97,51.31 237.24,51.31 234.31,54.23 K3.S
NO4
  Bottom 0.61: X6.2 281.14,33.53 266.7,33.53 263.65,30.48 254.25,30.48 251.46,33.27 237.24,33.27 K4.S
RST
  Top 0.813: S1.2 S1.1
  Bottom 0.813: S1.2 182.65,64.29 J1.5 161.04,65.02 IC4.1 | S1.1 182.63,54.89 R22.P$1
SCL  (2 unrouted)
  Bottom 0.61: IC4.28 R24.P$1
SDA  (2 unrouted)
  Bottom 0.61: IC4.27 155.7,42.93 155.96,42.67 R23.P$1
SN1
  Bottom 0.61: 280.96,114.55 X2.2 268.52,114.77 265.43,117.86 R10.P$2
SN2
  Bottom 0.61: R13.P$2 264.41,114.05 273.69,104.77 X2.4
SN3
  Bottom 0.61: 281.14,94.49 X3.2 271.06,94.45 268.48,97.03 268.48,105.16 263.4,110.24 R16.P$2
SN4
  Bottom 0.61: R19.P$2 263.14,106.43 265.68,103.89 265.68,86.11 267.46,84.33 280.92,84.33 281.04,84.45 X3.4
VBAT  (2 unrouted)
XTAL1  (1 unrouted)
  Bottom 0.406: 139.19,71.37 C3.2
  Bottom 0.61: 139.19,71.37 139.95,70.61 CRYSTAL.1 | IC4.9 137.92,67.06
XTAL2  (1 unrouted)
  Bottom 0.406: 136.65,70.61 136.4,70.87 136.4,74.93
  Bottom 0.61: CRYSTAL.2 136.65,70.61 135.38,69.34 IC4.10